# Altium schematic sheet USB_to_UART.SchDoc
size A; SheetNumber: 4; SheetTotal: 5
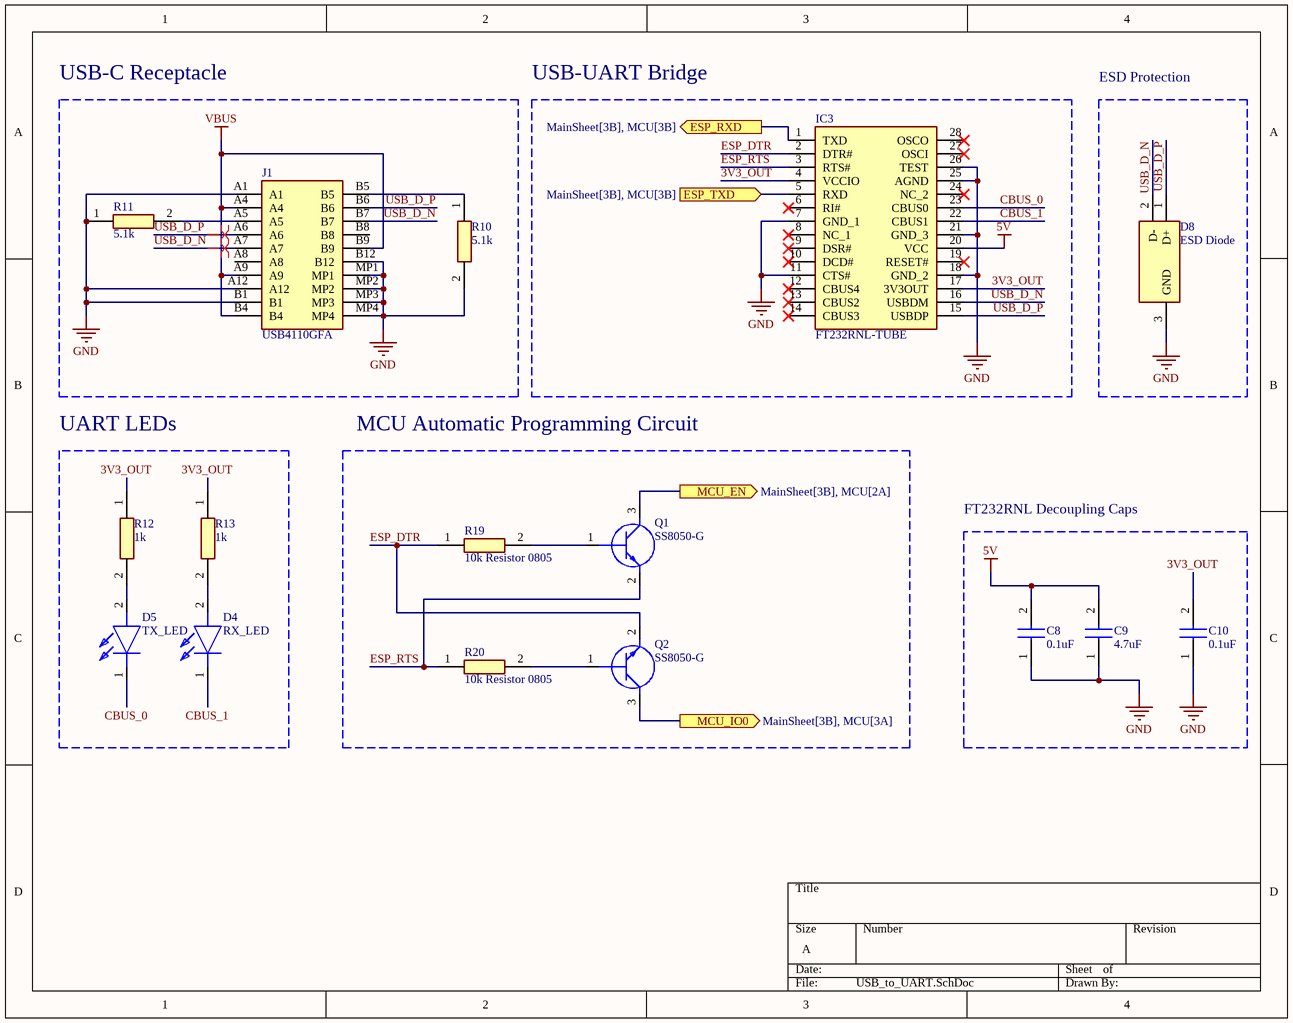
[diagram p0: USB_to_UART.SchDoc]

## Parts
C8  0.1uF  [CAPC2012X88N]
C9  4.7uF  [C0805]
C10  0.1uF  [CAPC2012X88N]
D4  RX_LED  [LEDC2012X85N]
D5  TX_LED  [LEDC2012X85N]
D8  ESD Diode  [SOTFL35P100X50-3N]
IC3  FT232RNL-TUBE  [SOP65P780X200-28N]
J1  USB4110GFA  [USB4110GFA]
Q1  SS8050-G  [SOT95P240X115-3N]
Q2  SS8050-G  [SOT95P240X115-3N]
R10  5.1k  [RESC2012X60N]
R11  5.1k  [RESC2012X60N]
R12  1k  [RESC2012X60N]
R13  1k  [RESC2012X60N]
R19  10k Resistor 0805  [ERA6AEB101V]
R20  10k Resistor 0805  [ERA6AEB101V]

## Blocks framed on the sheet
USB-C Receptacle: J1 R10 R11
USB-UART Bridge: IC3
ESD Protection: D8
UART LEDs: D4 D5 R12 R13
MCU Automatic Programming Circuit: Q1 Q2 R19 R20
FT232RNL Decoupling Caps: C8-C10

## Ports
ESP_RXD (out, see MainSheet[3B], MCU[3B]), ESP_TXD (in, see MainSheet[3B], MCU[3B]), MCU_EN (out, see MainSheet[3B], MCU[2A]), MCU_IO0 (out, see MainSheet[3B], MCU[3A])

## Nets
5V: C8.2 C9.2 IC3.20(VCC)
GND: C8.1 C9.1 C10.1 D8.3(GND) IC3.7(GND_1) IC3.11(CTS#) IC3.18(GND_2) IC3.21(GND_3) IC3.25(AGND) IC3.26(TEST) J1.A1 J1.A12 J1.B1 J1.B12 J1.MP1 J1.MP2 J1.MP3 J1.MP4 R10.2 R11.1
VBUS: J1.A4 J1.A9 J1.B4 J1.B9
3V3_OUT: C10.2 IC3.4(VCCIO) IC3.17(3V3OUT) R12.1 R13.1
CBUS_0: D5.1(K) IC3.23(CBUS0)
CBUS_1: D4.1(K) IC3.22(CBUS1)
ESP_DTR: IC3.2(DTR#) Q2.2(E) R19.1
ESP_RTS: IC3.3(RTS#) Q1.2(E) R20.1
ESP_RXD: IC3.1(TXD) ; port ESP_RXD
ESP_TXD: IC3.5(RXD) ; port ESP_TXD
MCU_EN: Q1.3(C) ; port MCU_EN
MCU_IO0: Q2.3(C) ; port MCU_IO0
USB_D_N: D8.2(D-) IC3.16(USBDM) J1.A7 J1.B7
USB_D_P: D8.1(D+) IC3.15(USBDP) J1.A6 J1.B6
NetD4_2: D4.2(A) R13.2
NetD5_2: D5.2(A) R12.2
NetJ1_A5: J1.A5 R11.2
NetJ1_B5: J1.B5 R10.1
NetQ1_1: Q1.1(B) R19.2
NetQ2_1: Q2.1(B) R20.2

Not connected (* = marked no-connect by the designer): IC3 6(RI#)* 8(NC_1)* 9(DSR#)* 10(DCD#)* 12(CBUS4)* 13(CBUS2)* 14(CBUS3)* 19(RESET#)* 24(NC_2)* 27(OSCI)* 28(OSCO)*; J1 A8 B8

## Layout directives
differential pair: USB_D_N, USB_D_P

## Library data of the parts
C8 C10 = 0.1uF Capacitor 0805: Capacitor; Manufacturer_Name: Yageo Group; Manufacturer_Part_Number: C0805C104K5RAC-TU; Datasheet Link: https://componentsearchengine.com/Datasheets/2/C0805C104K5RAC-TU.pdf; Height: 0.88mm; Arrow Part Number: C0805C104K5RAC-TU; Arrow Price/Stock: https://www.arrow.com/en/products/c0805c104k5ractu/kemet-corporation
C9 = 4.7uF Capacitor 0805: Capacitor; Manufacturer_Name: Yageo Group; Manufacturer_Part_Number: C0805X475M8RACTU; Datasheet Link: https://www.yageogroup.com/content/datasheet/asset/file/KEM_C1013_X7R_FT-CAP_SMD; Height: 1.1mm; Mouser Part Number: 80-C0805X475M8R; Mouser Price/Stock: https://www.mouser.com/Search/Refine.aspx?Keyword=80-C0805X475M8R; Arrow Part Number: C0805X475M8RACTU; Arrow Price/Stock: https://www.arrow.com/en/products/c0805x475m8ractu/kemet-corporation
D4 D5 = Green LED: LED; Manufacturer_Name: Kingbright; Manufacturer_Part_Number: APT2012SGC; Datasheet Link: http://www.us.kingbright.com/images/catalog/SPEC/APT2012SGC.pdf; Height: 0.85mm; Mouser Part Number: 604-APT2012SGC; Mouser Price/Stock: https://www.mouser.co.uk/ProductDetail/Kingbright/APT2012SGC?qs=SxaZfIVsCL28XycY%2FuxqiQ%3D%3D; Arrow Part Number: APT2012SGC; Arrow Price/Stock: https://www.arrow.com/en/products/apt2012sgc/kingbright?region=nac
D8 = ESD Diode: Diode; Manufacturer_Name: Texas Instruments; Manufacturer_Part_Number: TPD2EUSB30DRTR; Datasheet Link: https://datasheet.datasheetarchive.com/originals/distributors/SFDatasheet-11/sf-000234749.pdf; Height: 0.5mm; Mouser Part Number: 595-TPD2EUSB30DRTR; Mouser Price/Stock: https://www.mouser.co.uk/ProductDetail/Texas-Instruments/TPD2EUSB30DRTR?qs=%2Fqzd9s%252BcLd6bPJi5HXCDvw%3D%3D; Arrow Part Number: TPD2EUSB30DRTR; Arrow Price/Stock: https://www.arrow.com/en/products/tpd2eusb30drtr/texas-instruments?utm_currency=USD&region=nac
IC3 = FT232RNL-TUBE: Integrated Circuit; Manufacturer_Name: FTDI Chip; Datasheet Link: https://ftdichip.com/wp-content/uploads/2023/03/DS_FT232RN.pdf; Height: 2mm; Manufacturer_Part_Number: FT232RNL-TUBE; Mouser Part Number: 895-FT232RNL-TUBE; Mouser Price/Stock: https://www.mouser.co.uk/ProductDetail/FTDI/FT232RNL-TUBE?qs=By6Nw2ByBD3n6DWgWW3egA%3D%3D; Arrow Part Number: FT232RNL-TUBE; Arrow Price/Stock: https://www.arrow.com/en/products/ft232rnl-tube/ftdi-chip?utm_currency=USD&region=europe
J1 = USB-C Receptacle: Connector; Manufacturer_Name: GCT (GLOBAL CONNECTOR TECHNOLOGY); Manufacturer_Part_Number: USB4110-GF-A; Datasheet Link: https://gct.co/files/drawings/usb4110.pdf; Height: 3.26mm; Mouser Part Number: 640-USB4110-GF-A; Mouser Price/Stock: https://www.mouser.co.uk/ProductDetail/GCT/USB4110-GF-A?qs=KUoIvG%2F9IlYiZvIXQjyJeA%3D%3D
Q1 Q2 = SS8050-G: Transistor BJT NPN; Manufacturer_Name: Comchip Technology; Datasheet Link: https://datasheet.datasheetarchive.com/originals/distributors/DKDS-12/229454.pdf; Height: 1.15mm; Manufacturer_Part_Number: SS8050-G; Mouser Part Number: 750-SS8050-G; Mouser Price/Stock: https://www.mouser.co.uk/ProductDetail/Comchip-Technology/SS8050-G?qs=LLUE9lz1YbcHg%252BWLMAtcrQ%3D%3D; Arrow Part Number: SS8050-G; Arrow Price/Stock: https://www.arrow.com/en/products/ss8050-g/comchip-technology?region=nac
R10 R11 = 5.1k Resistor 0805: Resistor; Manufacturer_Name: Vishay; Manufacturer_Part_Number: CRCW08055K10JNEAHP; Datasheet Link: https://componentsearchengine.com/Datasheets/1/CRCW08051R00FKEAHP.pdf; Height: 0.6mm; Mouser Part Number: 71-CRCW08055K10JNEAH; Mouser Price/Stock: https://www.mouser.co.uk/ProductDetail/Vishay/CRCW08055K10JNEAHP?qs=hWgE7mdIu5RTpd75lMnc9Q%3D%3D
R12 R13 = 1k Resistor: Resistor; Manufacturer_Name: Yageo Group; Manufacturer_Part_Number: RC0805FR-071KL; Datasheet Link: https://www.yageo.com/upload/media/product/productsearch/datasheet/rchip/PYu-RC_Group_51_RoHS_L_11.pdf; Height: 0.6mm; Mouser Part Number: 603-RC0805FR-071KL; Mouser Price/Stock: https://www.mouser.co.uk/ProductDetail/YAGEO/RC0805FR-071KL?qs=1ogmaHw32WJjeGY0DHXakQ%3D%3D; Arrow Part Number: RC0805FR-071KL; Arrow Price/Stock: https://www.arrow.com/en/products/rc0805fr-071kl/yageo?utm_currency=USD&region=europe
R19 R20 = 10k Resistor 0805: Resistor; Manufacturer_Name: Panasonic; Manufacturer_Part_Number: ERA-6AED103V; Datasheet Link: https://industrial.panasonic.com/cdbs/www-data/pdf/RDM0000/AOA0000C307.pdf; Height: 0.6mm; Mouser Part Number: 667-ERA-6AED103V; Mouser Price/Stock: https://www.mouser.co.uk/ProductDetail/Panasonic/ERA-6AED103V?qs=MNPzkKEzRtSGdYymydDO9g%3D%3D; Arrow Part Number: ERA-6AED103V; Arrow Price/Stock: https://www.arrow.com/en/products/era-6aed103v/panasonic?region=nac